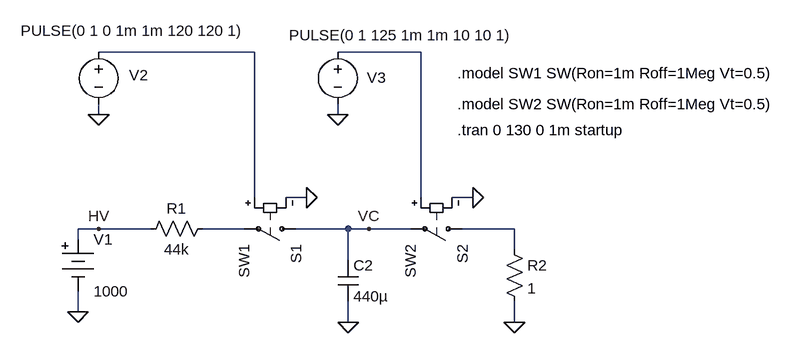
[diagram p0: schematic descargaCapacitor.asc]
descargaCapacitor.asc, the LTspice schematic file:
Version 4
SHEET 1 992 680
WIRE 112 -112 -128 -112
WIRE 368 -112 240 -112
WIRE -128 -16 -128 -32
WIRE 240 -16 240 -32
WIRE 112 112 112 -112
WIRE 192 112 160 112
WIRE 368 112 368 -112
WIRE 448 112 416 112
WIRE -128 160 -160 160
WIRE -48 160 -128 160
WIRE 96 160 32 160
WIRE 256 160 176 160
WIRE 288 160 256 160
WIRE 352 160 288 160
WIRE 512 160 432 160
WIRE -160 176 -160 160
WIRE 512 192 512 160
WIRE 256 208 256 160
WIRE -160 288 -160 256
WIRE 256 304 256 272
WIRE 512 304 512 272
FLAG 512 304 0
FLAG -128 -16 0
FLAG 240 -16 0
FLAG 192 112 0
FLAG 448 112 0
FLAG -160 288 0
FLAG 256 304 0
FLAG 288 160 VC
FLAG -128 160 HV
SYMBOL res -64 176 R270
WINDOW 0 32 56 VTop 2
WINDOW 3 0 56 VBottom 2
SYMATTR InstName R1
SYMATTR Value 44k
SYMBOL sw 448 160 R90
SYMATTR InstName S2
SYMATTR Value SW2
SYMBOL res 496 176 R0
SYMATTR InstName R2
SYMATTR Value 1
SYMBOL Misc\\battery -160 160 R0
WINDOW 123 0 0 Left 2
WINDOW 39 0 0 Left 2
SYMATTR InstName V1
SYMATTR Value 1000
SYMBOL voltage -128 -128 R0
WINDOW 123 0 0 Left 2
WINDOW 39 0 0 Left 2
WINDOW 0 47 51 Left 2
WINDOW 3 -120 -17 Left 2
SYMATTR InstName V2
SYMATTR Value PULSE(0 1 0 1m 1m 120 120 1)
SYMBOL voltage 240 -128 R0
WINDOW 123 0 0 Left 2
WINDOW 39 0 0 Left 2
WINDOW 0 45 55 Left 2
WINDOW 3 -75 -10 Left 2
SYMATTR InstName V3
SYMATTR Value PULSE(0 1 125 1m 1m 10 10 1)
SYMBOL cap 240 208 R0
SYMATTR InstName C2
SYMATTR Value 440µ
SYMBOL sw 192 160 R90
SYMATTR InstName S1
SYMATTR Value SW1
TEXT 424 -80 Left 2 !.model SW1 SW(Ron=1m Roff=1Meg Vt=0.5)
TEXT 424 -32 Left 2 !.model SW2 SW(Ron=1m Roff=1Meg Vt=0.5)
TEXT 424 8 Left 2 !.tran 0 130 0 1m startup

The netlist it stands for:
* descargaCapacitor.asc
R1 HV N003 44k
S2 N004 VC N002 0 SW2
R2 N004 0 1
V1 HV 0 1000
V2 N001 0 PULSE(0 1 0 1m 1m 120 120 1)
V3 N002 0 PULSE(0 1 125 1m 1m 10 10 1)
C2 VC 0 440µ
S1 VC N003 N001 0 SW1
.model SW1 SW(Ron=1m Roff=1Meg Vt=0.5)
.model SW2 SW(Ron=1m Roff=1Meg Vt=0.5)
.tran 0 130 0 1m startup
.backanno
.end

* Results of the author's LTspice run, read from the files saved beside the schematic
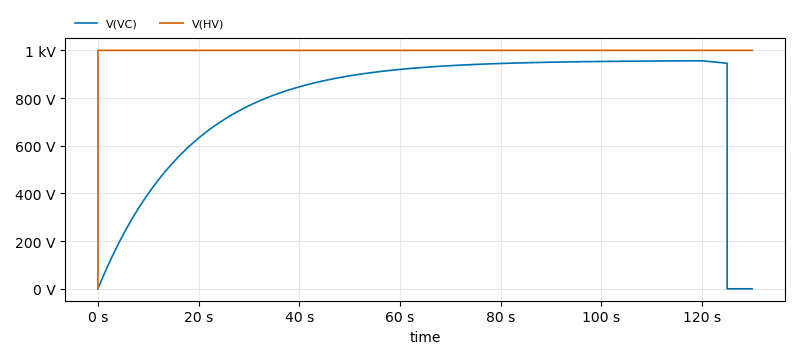
[diagram p1: Transient Analysis of descargaCapacitor.asc, plotted from the saved traces]
* Transient Analysis, 1 run:
*   V(VC): min 0 V, max 956.4 V, average 784.3 V, rms 828.1 V, last 958.8 µV
*   V(HV): min 0 V, max 1 kV, average 1 kV, rms 1 kV, last 1 kV